# Altium project Kar_PCB.PrjPcb
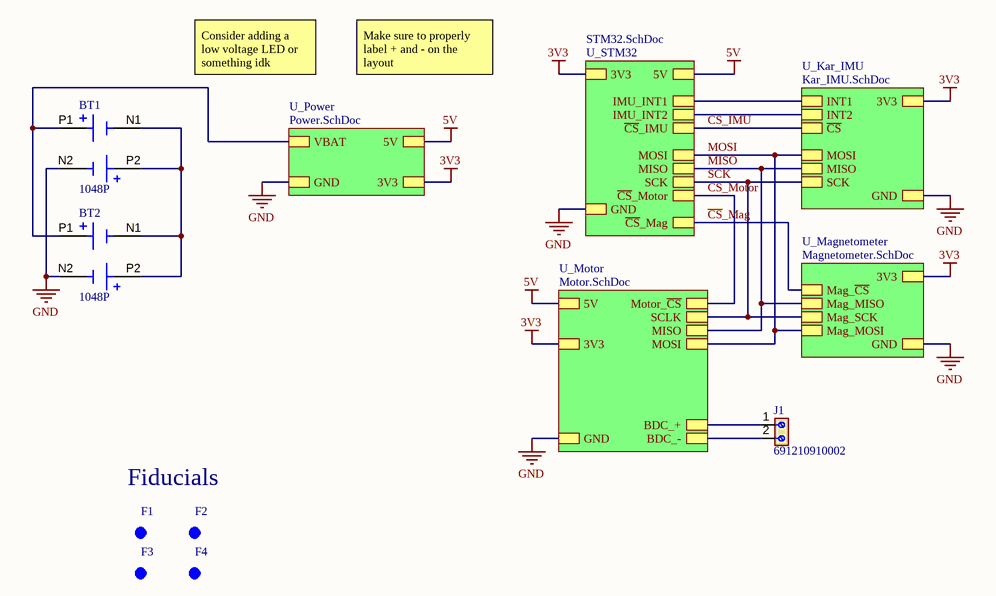
[diagram p0: Kar_PCB.SchDoc]
CAGE_CODE: ?????; CONTRACT_NUMBER: <CONTRACT NO>; DOC_NO_ASSY_DWG: <ASSY DWG NO>; DOC_NO_BOM: <BOM DOC NO>; DOC_NO_FAB_DWG: <FAB DWG NO>; DOC_NO_SCH_DWG: <SCH DWG NO>; PCB_2_DEC_TOL: +/-.01; PCB_3_DEC_TOL: +/-.010; PCB_ANG_TOL: +/-1/2; PCB_ASSEMBLY_NO: <PCB ASSY NO>; PCB_CHECKER: - -----; PCB_CHECKER_APP_DATE: --/--/----; PCB_DESIGNER: - -----; PCB_DESIGNER_APP_DATE: --/--/----; PCB_DWG_NO: <PCB DWG NO>; PCB_ENGINEER: - -----; PCB_ENGINEER_APP_DATE: --/--/----; PCB_PART_NUMBER: <PCB PN>; PCB_REV: A; SCH_REV: A
6 sheets, 55 parts. Net scope: strictly hierarchical (ports join the sheet entries above them; power ports are local).
Board file: Kar_PCB.PcbDoc
Sheets:
  Kar_PCB.SchDoc
    U_Motor = Motor.SchDoc
    U_Power = Power.SchDoc
    U_STM32 = STM32.SchDoc
    U_Kar_IMU = Kar_IMU.SchDoc
    U_Magnetometer = Magnetometer.SchDoc

## Sheet Kar_PCB.SchDoc
size 241 x 190 mm; SheetNumber: 1; SheetTotal: 6; ENG_APP_DATE: --/--/--; DSN_APP_DATE: --/--/--; CHK_APP_DATE: --/--/--

### Parts
BT1  1048P  [BAT_1048P]
BT2  1048P  [BAT_1048P]
F1  Fiducial  [Fiducial_Footprint]  (value not drawn)
F2  Fiducial  [Fiducial_Footprint]  (value not drawn)
F3  Fiducial  [Fiducial_Footprint]  (value not drawn)
F4  Fiducial  [Fiducial_Footprint]  (value not drawn)
J1  691210910002  [691210910002]

### Sub-sheets
U_Kar_IMU = Kar_IMU.SchDoc: 3V3, GND, ~{CS}, SCK, MISO, MOSI, INT1, INT2
U_Magnetometer = Magnetometer.SchDoc: 3V3, GND, Mag_~{CS}, Mag_MISO, Mag_SCK, Mag_MOSI
U_Motor = Motor.SchDoc: 5V, GND, BDC_+, BDC_-, MOSI, Motor_~{CS}, SCLK, 3V3, MISO
U_Power = Power.SchDoc: VBAT, GND, 5V, 3V3
U_STM32 = STM32.SchDoc: MOSI, MISO, SCK, 3V3, GND, ~{CS}_Motor, ~{CS}_IMU, IMU_INT2, IMU_INT1, 5V, ~{CS}_Mag

### Nets
3V3: sheet U_Motor/3V3, sheet U_Power/3V3, sheet U_STM32/3V3, sheet U_Kar_IMU/3V3, sheet U_Magnetometer/3V3
5V: sheet U_Motor/5V, sheet U_Power/5V, sheet U_STM32/5V
GND: BT1.N2 BT2.N2 ; sheet U_Motor/GND, sheet U_Power/GND, sheet U_STM32/GND, sheet U_Kar_IMU/GND, sheet U_Magnetometer/GND
VBAT: BT1.P1 BT2.P1 ; sheet U_Power/VBAT
~{CS}_IMU: sheet U_STM32/~{CS}_IMU, sheet U_Kar_IMU/~{CS}
~{CS}_Mag: sheet U_STM32/~{CS}_Mag, sheet U_Magnetometer/Mag_~{CS}
~{CS}_Motor: sheet U_Motor/Motor_~{CS}, sheet U_STM32/~{CS}_Motor
MISO: sheet U_Motor/MISO, sheet U_STM32/MISO, sheet U_Kar_IMU/MISO, sheet U_Magnetometer/Mag_MISO
MOSI: sheet U_Motor/MOSI, sheet U_STM32/MOSI, sheet U_Kar_IMU/MOSI, sheet U_Magnetometer/Mag_MOSI
SCK: sheet U_Motor/SCLK, sheet U_STM32/SCK, sheet U_Kar_IMU/SCK, sheet U_Magnetometer/Mag_SCK
NetBT1_N1: BT1.N1 BT1.P2 BT2.N1 BT2.P2
NetJ1_1: J1.1 ; sheet U_Motor/BDC_+
NetJ1_2: J1.2 ; sheet U_Motor/BDC_-
NetMT1_4: sheet U_STM32/IMU_INT1, sheet U_Kar_IMU/INT1
NetMT1_9: sheet U_STM32/IMU_INT2, sheet U_Kar_IMU/INT2

### Notes on the sheet
- Consider adding a low voltage LED or something idk
- Make sure to properly label + and - on the layout
- Fiducials
- DWG. NO.
- REV.
- SHT.
- THIS DOCUMENT AND THE DATA DISCLOSED HEREIN OR HEREWITH IS THE PROPERTY OF ALTIUM LIMITED AND MAY BE FREELY DISTRIBUTED IN WHOLE. NO RIGHTS ARE RESERVED OR EXPRESS OR IMPLIED WARANTEE GIVEN.
- REVISION
- DESCRIPTION
- DATE
- APPROVED
- ENG:
- APPROVALS
- PROJECT
- DSN:
- CHK:
- REFERENCE DOCUMENTS
- PROJECT REVISION:
- TITLE
- DOCUMENT REVISION:
- DESIGN ITEM:
- BOM:
- FAB DWG:
- PCB DWG:
- ASSY DWG:
- SCALE:
- SIZE
- B
- CAGE CODE
- FILE NAME
- DWG NO.
- SHEET
- OF
- REV

### Library data of the parts
BT1 BT2 = 1048P: SMT Polarized Holder for Dual 18650 Batteries; MF: Keystone Electronics; Value: *; MP: 1048P; Price: None; Package: None; Availability: In Stock; SnapEDA_Link: https://www.snapeda.com/parts/1048P/Keystone+Electronics/view-part/?ref=snap; Purchase-URL: https://pricing.snapeda.com/search/part/1048P/?ref=eda; Check_prices: https://www.snapeda.com/parts/1048P/Keystone+Electronics/view-part/?ref=eda
J1 = 691210910002: MF: {'manufacturer': u'W\xfcrth Elektronik'}; Package: None; Price: None; Value: *; MP: 691210910002; Availability: Unavailable

## Sheet Motor.SchDoc
size A; SheetNumber: 3; SheetTotal: 6
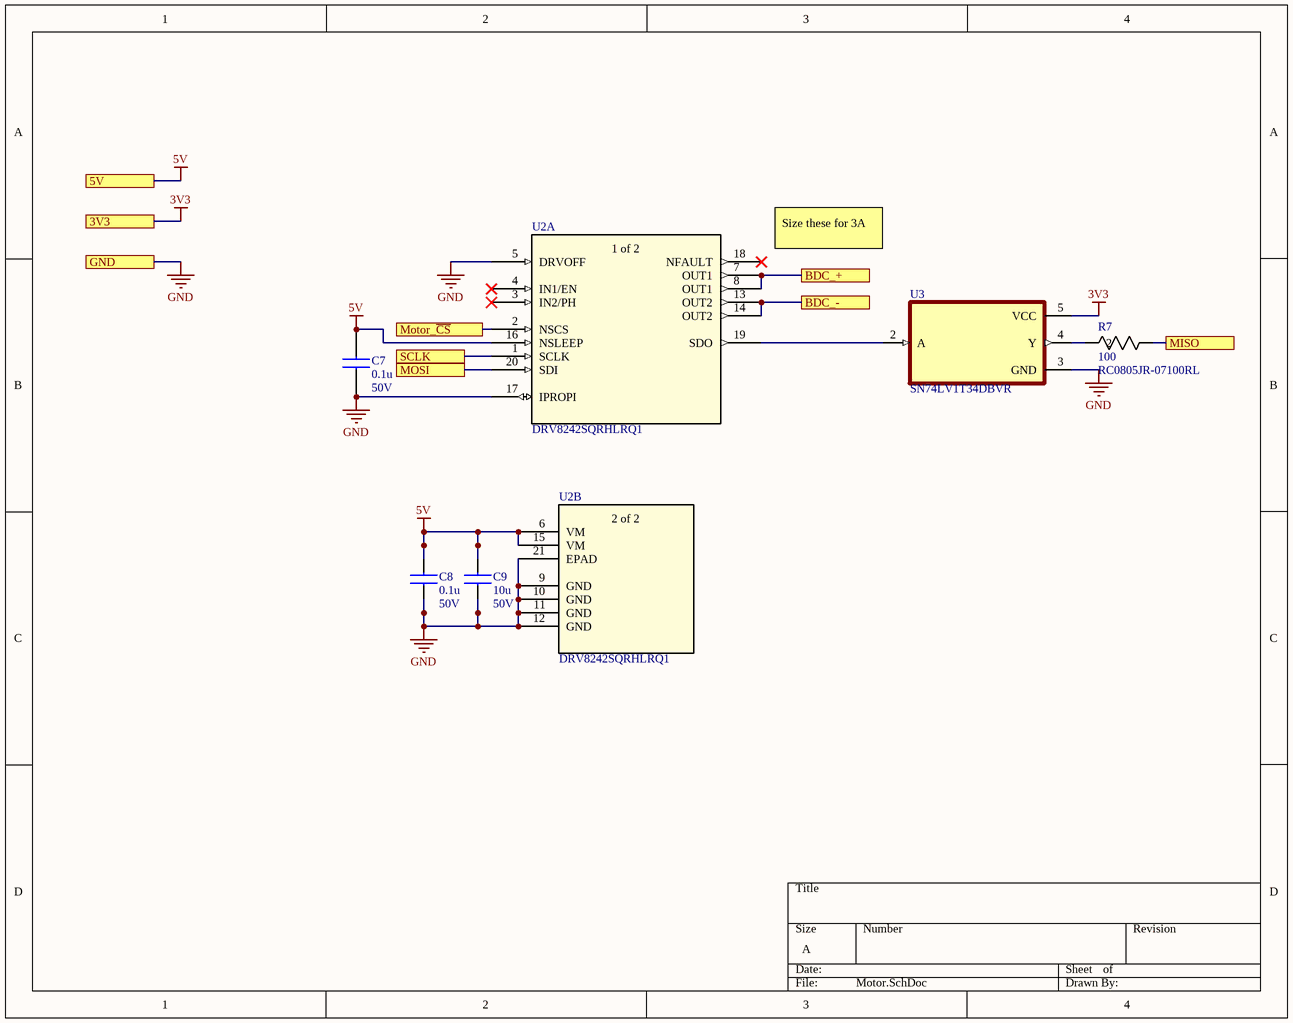
[diagram p1: Motor.SchDoc]

### Parts
C7  value 0.1u  Rated Voltage: 50V  [CAPC2012X145N]  (hidden comment: KAM21BR71H104JM)
C8  value 0.1u  Rated Voltage: 50V  [CAPC2012X145N]  (hidden comment: KAM21BR71H104JM)
C9  value 10u  Rated Voltage: 50V  [CAPC2012X145N]  (hidden comment: C2012X5R1H106K125AC)
R7  RC0805JR-07100RL  value 100  [RC0805N_YAG]
U2  DRV8242SQRHLRQ1  [VQFN20_RHL_TEX]  (parts A,B of 2)
U3  SN74LV1T34DBVR  [SOT95P280X145-5N]

### Ports
3V3, 5V, BDC_+, BDC_-, GND, MISO, MOSI, Motor_~{CS}, SCLK

### Nets
3V3: U3.5(VCC) ; port 3V3
5V: C7.2 C8.2 C9.2 U2.6(VM) U2.15(VM) U2.16(NSLEEP) ; port 5V
GND: C7.1 C8.1 C9.1 U2.5(DRVOFF) U2.9(GND) U2.10(GND) U2.11(GND) U2.12(GND) U2.17(IPROPI) U2.21(EPAD) U3.3(GND) ; port GND
~{CS}_Motor: U2.2(NSCS) ; port Motor_~{CS}
MISO: R7.1 ; port MISO
MOSI: U2.20(SDI) ; port MOSI
SCK: U2.1(SCLK) ; port SCLK
NetJ1_1: U2.7(OUT1) U2.8(OUT1) ; port BDC_+
NetJ1_2: U2.13(OUT2) U2.14(OUT2) ; port BDC_-
NetR7_2: R7.2 U3.4(Y)
NetU2_19: U2.19(SDO) U3.2(A)

Not connected (* = marked no-connect by the designer): U2 3(IN2/PH)* 4(IN1/EN)* 18(NFAULT)*

### Notes on the sheet
- Size these for 3A
- (in symbol DRV8242SQRHLRQ1, part A) 1 of 2
- (in symbol DRV8242SQRHLRQ1, part B) 2 of 2

### Library data of the parts
C7 C8 = KAM21BR71H104JM: Multilayer Ceramic Chip Capacitors, Capacitance=0.1u; Manufacturer_Part_Number: KAM21BR71H104JM
C9 = C2012X5R1H106K125AC: Multilayer Ceramic Chip Capacitors, Capacitance=10?F, LxWxT:2x1.25x1.25mm; Manufacturer_Name: TDK; Geometry.Height: 1.45mm; Mouser Part Number: 810-C2012X5R1H106K12; Mouser Price/Stock: https://www.mouser.co.uk/ProductDetail/TDK/C2012X5R1H106K125AC?qs=rSMjJ%252B1ewcQGpfDVduhUmg%3D%3D; Manufacturer_Part_Number: C2012X5R1H106K125AC; Datasheet Link: https://product.tdk.com/info/en/catalog/datasheets/mlcc_commercial_midvoltage_en.pdf
R7 = RC0805JR-07100RL: RES 0805 100 5% 1/8W; Manufacturer_Name: Yageo; Manufacturer_Part_Number: RC0805JR-07100RL; Tolerance: 5%
U2 = DRV8242SQRHLRQ1: Automotive, 40-V 6-A H-bridge driver with integrated current sensing and feedback 20-VQFN -40 to 125; Manufacturer_Name: Texas Instruments; Type: Power Management; Copyright: Copyright (C) 2025 Ultra Librarian. All rights reserved.; Manufacturer_Part_Number: DRV8242SQRHLRQ1; Datasheet: https://www.ti.com/lit/gpn/drv8242-q1; RefDes: RefDes
U3 = SN74LV1T34DBVR: Single Power Supply BUFFER Logic Level Shifter (no enable); MF: Texas Instruments; SnapEDA_Link: https://www.snapeda.com/parts/SN74LV1T34DBVR/Texas+Instruments/view-part/?ref=snap; Package: SOT-23-5 Texas Instruments; Value: *; MP: SN74LV1T34DBVR; Check_prices: https://www.snapeda.com/parts/SN74LV1T34DBVR/Texas+Instruments/view-part/?ref=eda

## Sheet Power.SchDoc
size A; SheetNumber: 2; SheetTotal: 6
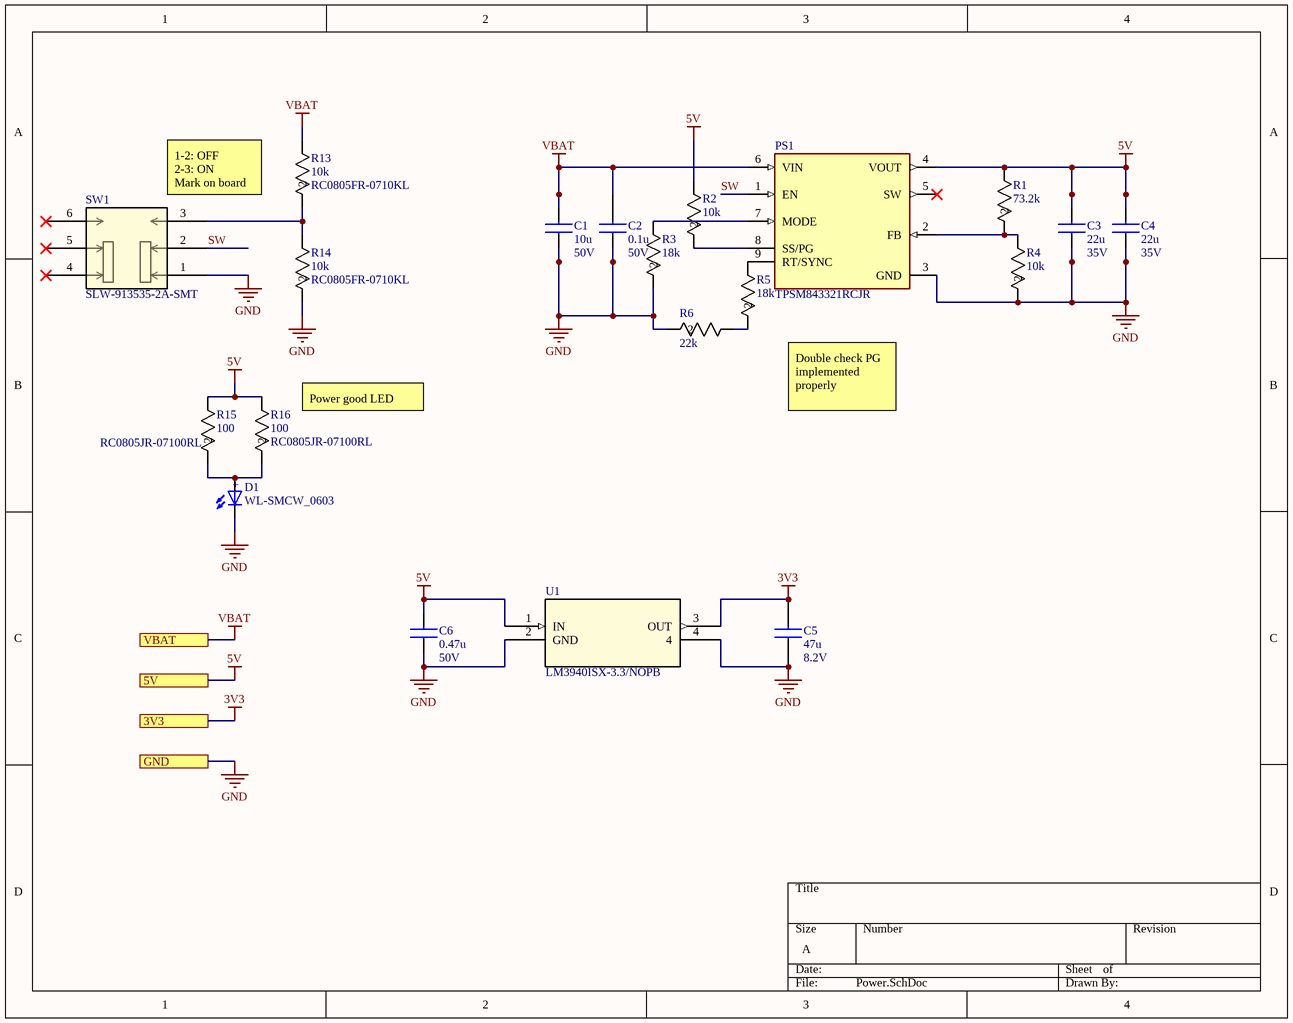
[diagram p2: Power.SchDoc]

### Parts
C1  value 10u  Rated Voltage: 50V  [CAPC2012X145N]  (hidden comment: C2012X5R1H106K125AC)
C2  value 0.1u  Rated Voltage: 50V  [CAPC2012X145N]  (hidden comment: KAM21BR71H104JM)
C3  value 22u  Rated Voltage: 35V  [CAPC2012X145N]  (hidden comment: C2012X5R1V226M125AC)
C4  value 22u  Rated Voltage: 35V  [CAPC2012X145N]  (hidden comment: C2012X5R1V226M125AC)
C5  value 47u  Rated Voltage: 8.2V  [CAPC2012X145N]  (hidden comment: T58W0476M8R2C0500)
C6  value 0.47u  Rated Voltage: 50V  [CAPC2012X145N]  (hidden comment: GCM21BR71H474KA55K)
D1  WL-SMCW_0603  [WL-SMCW_0603]
PS1  TPSM843321RCJR  [MODULE_TPSM843321RCJR]
R1  value 73.2k  [RC0805N_YAG]  (hidden comment: RC0805FR-0773K2L)
R2  value 10k  [RC0805N_YAG]  (hidden comment: RC0805FR-0710KL)
R3  value 18k  [RC0805N_YAG]  (hidden comment: RC0805FR-0718KL)
R4  value 10k  [RC0805N_YAG]  (hidden comment: RC0805FR-0710KL)
R5  value 18k  [RC0805N_YAG]  (hidden comment: RC0805FR-0718KL)
R6  value 22k  [RC0805N_YAG]  (hidden comment: RC0805FR-0722KL)
R13  RC0805FR-0710KL  value 10k  [RC0805N_YAG]
R14  RC0805FR-0710KL  value 10k  [RC0805N_YAG]
R15  RC0805JR-07100RL  value 100  [RC0805N_YAG]
R16  RC0805JR-07100RL  value 100  [RC0805N_YAG]
SW1  SLW-913535-2A-SMT  [SLW-913535_CUD]
U1  LM3940ISX-3.3/NOPB  [TS3B]

### Ports
3V3, 5V, GND, VBAT

### Nets
3V3: C5.2 U1.3(OUT) ; port 3V3
5V: C3.2 C4.2 C6.2 PS1.4(VOUT) R1.1 R2.1 R15.1 R16.1 U1.1(IN) ; port 5V
GND: C1.1 C2.1 C3.1 C4.1 C5.1 C6.1 D1.1(NEG) PS1.3(GND) R3.2 R4.2 R6.2 R14.2 SW1.1 U1.2(GND) U1.4 ; port GND
VBAT: C1.2 C2.2 PS1.6(VIN) R13.1 ; port VBAT
SW: PS1.1(EN) SW1.2
NetD1_2: D1.2(POS) R15.2 R16.2
NetPS1_2: PS1.2(FB) R1.2 R4.1
NetPS1_7: PS1.7(MODE) R3.1
NetPS1_8: PS1.8(SS/PG) R2.2
NetPS1_9: PS1.9(RT/SYNC) R5.1
NetR5_2: R5.2 R6.1
NetR13_2: R13.2 R14.1 SW1.3

Not connected (* = marked no-connect by the designer): PS1 5(SW)*; SW1 4* 5* 6*

### Notes on the sheet
- 1-2: OFF
  2-3: ON
  Mark on board
- (near R16) Power good LED
- Double check PG implemented properly
- (in symbol WL-SMCW_0603) +

### Library data of the parts
C1 = C2012X5R1H106K125AC: as C9 on sheet Motor; Mouser Part Number: 810-C2012X5R1H106K12; Mouser Price/Stock: https://www.mouser.co.uk/ProductDetail/TDK/C2012X5R1H106K125AC?qs=rSMjJ%252B1ewcQGpfDVduhUmg%3D%3D; Manufacturer_Part_Number: C2012X5R1H106K125AC; Datasheet Link: https://product.tdk.com/info/en/catalog/datasheets/mlcc_commercial_midvoltage_en.pdf
C2 = KAM21BR71H104JM: as C7 on sheet Motor; Manufacturer_Part_Number: KAM21BR71H104JM
C3 C4 = C2012X5R1V226M125AC: Multilayer Ceramic Chip Capacitors, Capacitance=22u; Manufacturer_Part_Number: C2012X5R1V226M125AC
C5 = T58W0476M8R2C0500: 47 µF Molded Tantalum Polymer Capacitor 8.2 V 0805 (2012 Metric) 500mOhm @ 100kHz; Manufacturer_Part_Number: T58W0476M8R2C0500
C6 = GCM21BR71H474KA55K: Multilayer Ceramic Chip Capacitors, Capacitance=0.47u; Manufacturer_Part_Number: GCM21BR71H474KA55K
D1 = WL-SMCW_0603: 0603, Green Typ.(@20mA): 520nm, 430mcd, 3.2V, 140Â° InGaN; MF: Wurth Electronics; MP: 150060GS75000; SnapEDA_Link: https://www.snapeda.com/parts/150060GS75000/Wurth+Electronics/view-part/?ref=snap; Package: 0603 WÃ¼rth Elektronik; Value: *; Check_prices: https://www.snapeda.com/parts/150060GS75000/Wurth+Electronics/view-part/?ref=eda
PS1 = TPSM843321RCJR: Non-Isolated PoL Module DC DC Converter 1 Output 5V 3A 3.8V - 18V Input; MF: Texas Instruments; SnapEDA_Link: https://www.snapeda.com/parts/TPSM843321RCJR/Texas+Instruments/view-part/?ref=snap; Package: None; Value: *; MP: TPSM843321RCJR; Check_prices: https://www.snapeda.com/parts/TPSM843321RCJR/Texas+Instruments/view-part/?ref=eda
R1 = RC0805FR-0773K2L: RES 0805 73.2k 1% 1/8W; Manufacturer_Name: Yageo; Manufacturer_Part_Number: RC0805FR-0773K2L; Tolerance: 1%
R2 R4 R13 R14 = RC0805FR-0710KL: RES 0805 10k 1% 1/8W; Manufacturer_Name: Yageo; Manufacturer_Part_Number: RC0805FR-0710KL; Tolerance: 1%
R3 R5 = RC0805FR-0718KL: RES 0805 18k 1% 1/8W; Manufacturer_Name: Yageo; Manufacturer_Part_Number: RC0805FR-0718KL; Tolerance: 1%
R6 = RC0805FR-0722KL: RES 0805 22k 1% 1/8W; Manufacturer_Name: Yageo; Manufacturer_Part_Number: RC0805FR-0722KL; Tolerance: 1%
R15 R16 = RC0805JR-07100RL: as R7 on sheet Motor; Manufacturer_Part_Number: RC0805JR-07100RL; Tolerance: 5%
SW1 = SLW-913535-2A-SMT: No Description Available; Manufacturer_Name: Same Sky; Type: Slide Switches; Copyright: Copyright (C) 2025 Ultra Librarian. All rights reserved.; Manufacturer_Part_Number: SLW-913535-2A-SMT; RefDes: RefDes
U1 = LM3940ISX-3.3NOPB: 1-A, low-dropout voltage regulator for 5-V to 3.3-V conversion 3-DDPAK/TO-263 -40 to 125; Manufacturer_Name: Texas Instruments; Type: LM3940IS-3.3; Copyright: Copyright (C) 2025 Ultra Librarian. All rights reserved.; Manufacturer_Part_Number: LM3940ISX-3.3/NOPB; Datasheet: https://www.ti.com/lit/gpn/lm3940; RefDes: RefDes

## Sheet STM32.SchDoc
size A; SheetNumber: 4; SheetTotal: 6
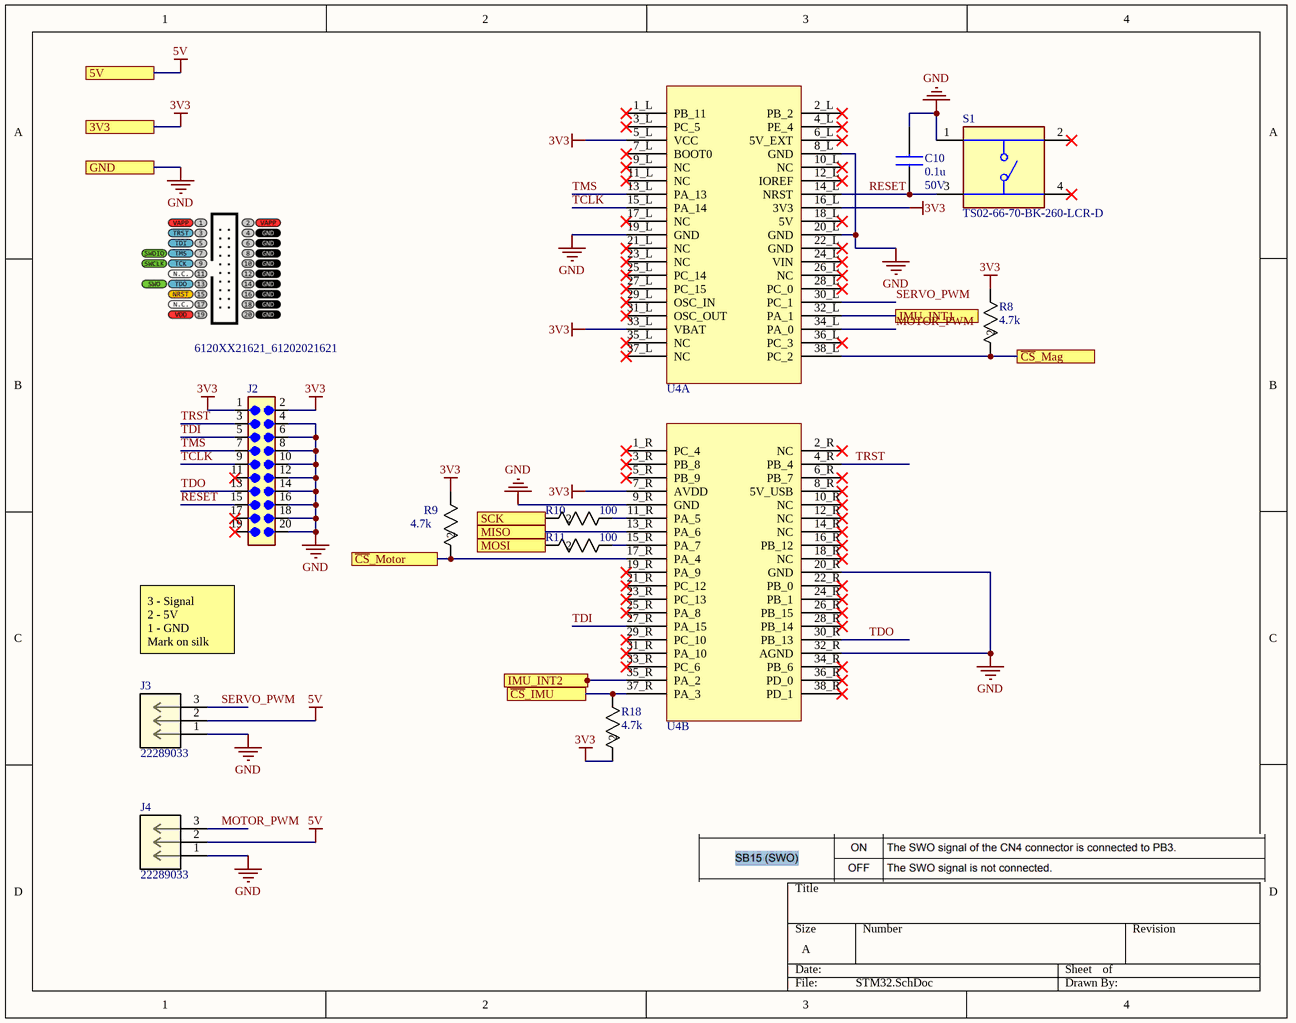
[diagram p3: STM32.SchDoc]

### Parts
C10  value 0.1u  Rated Voltage: 50V  [CAPC2012X145N]  (hidden comment: KAM21BR71H104JM)
J2  6120XX21621_61202021621  [61202021621]
J3  22289033  [CONN03_22289033_MOL]
J4  22289033  [CONN03_22289033_MOL]
R8  value 4.7k  [RC0805N_YAG]  (hidden comment: RC0805JR-074K7L)
R9  value 4.7k  [RC0805N_YAG]  (hidden comment: RC0805JR-074K7L)
R10  value 100  [RC0805N_YAG]  (hidden comment: RC0805JR-07100RL)
R11  value 100  [RC0805N_YAG]  (hidden comment: RC0805JR-07100RL)
R18  value 4.7k  [RC0805N_YAG]  (hidden comment: RC0805JR-074K7L)
S1  TS02-66-70-BK-260-LCR-D  [SW_TS02-66-70-BK-260-LCR-D]
U4  STM32_WB55  [PCBComponent_1]  (value not drawn)  (parts A,B of 2)

### Ports
3V3, 5V, GND, IMU_INT1, IMU_INT2, MISO, MOSI, SCK, ~{CS}_IMU, ~{CS}_Mag, ~{CS}_Motor

### Nets
3V3: J2.1 J2.2 R8.1 R9.1 R18.2 U4.5_L(VCC) U4.7_R(AVDD) U4.16_L(3V3) U4.33_L(VBAT) ; port 3V3
5V: J3.2 J4.2 ; port 5V
GND: C10.2 J2.4 J2.6 J2.8 J2.10 J2.12 J2.14 J2.16 J2.18 J2.20 J3.1 J4.1 S1.1 U4.8_L(GND) U4.9_R(GND) U4.19_L(GND) U4.20_L(GND) U4.20_R(GND) U4.32_R(AGND) ; port GND
~{CS}_IMU: R18.1 U4.37_R(PA_3) ; port ~{CS}_IMU
~{CS}_Mag: R8.2 U4.38_L(PC_2) ; port ~{CS}_Mag
~{CS}_Motor: R9.2 U4.17_R(PA_4) ; port ~{CS}_Motor
MISO: U4.13_R(PA_6) ; port MISO
MOSI: R11.2 ; port MOSI
MOTOR_PWM: J4.3 U4.34_L(PA_0)
RESET: C10.1 J2.15 S1.3 U4.14_L(NRST)
SCK: R10.2 ; port SCK
SERVO_PWM: J3.3 U4.30_L(PC_1)
TCLK: J2.9 U4.15_L(PA_14)
TDI: J2.5 U4.27_R(PA_15)
TDO: J2.13 U4.30_R(PB_13)
TMS: J2.7 U4.13_L(PA_13)
TRST: J2.3 U4.4_R(PB_4)
NetMT1_4: U4.32_L(PA_1) ; port IMU_INT1
NetMT1_9: U4.35_R(PA_2) ; port IMU_INT2
NetR10_1: R10.1 U4.11_R(PA_5)
NetR11_1: R11.1 U4.15_R(PA_7)

Not connected (* = marked no-connect by the designer): J2 11* 17* 19*; S1 2* 4*; U4 1_L(PB_11)* 1_R(PC_4)* 2_L(PB_2)* 2_R(NC)* 3_L(PC_5)* 3_R(PB_8)* 4_L(PE_4)* 5_R(PB_9)* 6_L(5V_EXT)* 6_R(PB_7)* 7_L(BOOT0)* 8_R(5V_USB)* 9_L(NC)* 10_L(NC)* 10_R(NC)* 11_L(NC)* 12_L(IOREF)* 12_R(NC)* 14_R(NC)* 16_R(PB_12)* 17_L(NC)* 18_L(5V)* 18_R(NC)* 19_R(PA_9)* 21_L(NC)* 21_R(PC_12)* 22_L(GND)* 22_R(PB_0)* 23_L(NC)* 23_R(PC_13)* 24_L(VIN)* 24_R(PB_1)* 25_L(PC_14)* 25_R(PA_8)* 26_L(NC)* 26_R(PB_15)* 27_L(PC_15)* 28_L(PC_0)* 28_R(PB_14)* 29_L(OSC_IN)* 29_R(PC_10)* 31_L(OSC_OUT)* 31_R(PA_10)* 33_R(PC_6)* 34_R(PB_6)* 35_L(NC)* 36_L(PC_3)* 36_R(PD_0)* 37_L(NC)* 38_R(PD_1)*

### Notes on the sheet
- 3 - Signal
  2 - 5V
  1 - GND
  Mark on silk

### Library data of the parts
C10 = KAM21BR71H104JM: as C7 on sheet Motor; Manufacturer_Part_Number: KAM21BR71H104JM
J2 = 6120XX21621_61202021621: MF: {'manufacturer': u'W\xfcrth Elektronik'}; Package: None; Price: None; Value: *; MP: 61202021621; Availability: Unavailable
J3 J4 = 22289033: KK 254 Breakaway Header, Right-Angle Surface Mount Compatible, 3 Circuits, 0.38Âµm Gold (Au) Selective Plating, Mating Pin Length 8.23mm, with Kinked PC Tails; Manufacturer_Name: Molex Connector Corporation; Copyright: Copyright (C) 2025 Ultra Librarian. All rights reserved.; Manufacturer_Part_Number: 22289033; Datasheet: https://www.molex.com/en-us/products/part-detail-pdf/22289033?display=pdf; RefDes: RefDes; Type: Type
R8 R9 R18 = RC0805JR-074K7L: RES 0805 4.7k 5% 1/8W; Manufacturer_Name: Yageo; Manufacturer_Part_Number: RC0805JR-074K7L; Tolerance: 5%
R10 R11 = RC0805JR-07100RL: as R7 on sheet Motor; Manufacturer_Part_Number: RC0805JR-07100RL; Tolerance: 5%
S1 = TS02-66-70-BK-260-LCR-D: 6 x 6 mm, 7 mm Actuator Height, 260 gf, Black, Long Crimped, Through Hole, SPST, Tactile Switch; MF: Same Sky; SnapEDA_Link: https://www.snapeda.com/parts/TS02-66-70-BK-260-LCR-D/Same+Sky/view-part/?ref=snap; Package: None; Value: *; MP: TS02-66-70-BK-260-LCR-D; Check_prices: https://www.snapeda.com/parts/TS02-66-70-BK-260-LCR-D/Same+Sky/view-part/?ref=eda

## Sheet Kar_IMU.SchDoc
size A; SheetNumber: 5; SheetTotal: 6
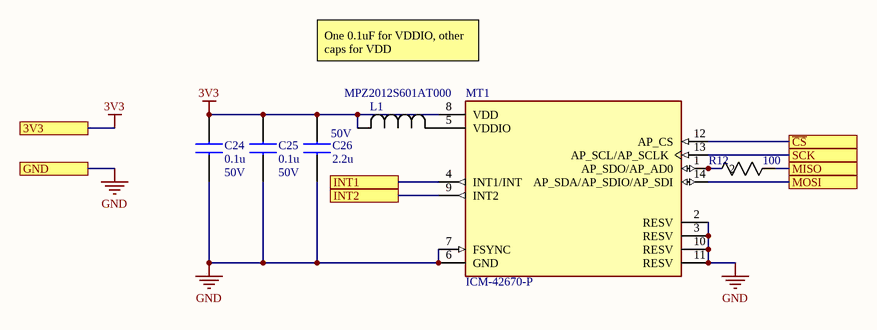
[diagram p4: Kar_IMU.SchDoc]

### Parts
C24  value 0.1u  Rated Voltage: 50V  [CAPC2012X145N]  (hidden comment: KAM21BR71H104JM)
C25  value 0.1u  Rated Voltage: 50V  [CAPC2012X145N]  (hidden comment: KAM21BR71H104JM)
C26  value 2.2u  Rated Voltage: 50V  [CAPC2012X145N]  (hidden comment: C2012X7R1H225K125AE)
L1  MPZ2012S601AT000  [IND_2012_TDK]
MT1  ICM-42670-P  [XDCR_ICM-42670-P]
R12  value 100  [RC0805N_YAG]  (hidden comment: RC0805JR-07100RL)

### Ports
3V3, GND, INT1, INT2, MISO, MOSI, SCK, ~{CS}

### Nets
3V3: C24.2 C25.2 C26.2 L1.2 MT1.8(VDD) ; port 3V3
GND: C24.1 C25.1 C26.1 MT1.2(RESV) MT1.3(RESV) MT1.6(GND) MT1.7(FSYNC) MT1.10(RESV) MT1.11(RESV) ; port GND
~{CS}_IMU: MT1.12(AP_CS) ; port ~{CS}
MISO: R12.1 ; port MISO
MOSI: MT1.14(AP_SDA/AP_SDIO/AP_SDI) ; port MOSI
SCK: MT1.13(AP_SCL/AP_SCLK) ; port SCK
NetL1_1: L1.1 MT1.5(VDDIO)
NetMT1_1: MT1.1(AP_SDO/AP_AD0) R12.2
NetMT1_4: MT1.4(INT1/INT) ; port INT1
NetMT1_9: MT1.9(INT2) ; port INT2

### Notes on the sheet
- One 0.1uF for VDDIO, other caps for VDD

### Library data of the parts
C24 C25 = KAM21BR71H104JM: as C7 on sheet Motor; Manufacturer_Part_Number: KAM21BR71H104JM
C26 = C2012X7R1H225K125AE: Multilayer Ceramic Chip Capacitors, Capacitance=2.2u; Manufacturer_Part_Number: C2012X7R1H225K125AE
L1 = MPZ2012S601AT000: No Description Available; Manufacturer_Name: TDK; Copyright: Copyright (C) 2025 Ultra Librarian. All rights reserved.; Manufacturer_Part_Number: MPZ2012S601AT000
R12 = RC0805JR-07100RL: as R7 on sheet Motor; Manufacturer_Part_Number: RC0805JR-07100RL; Tolerance: 5%
MT1 = ICM-42670-P: Package: None; Price: None; Value: *; MP: ICM-42670-P; Availability: Unavailable

## Sheet Magnetometer.SchDoc
size A; SheetNumber: 6; SheetTotal: 6
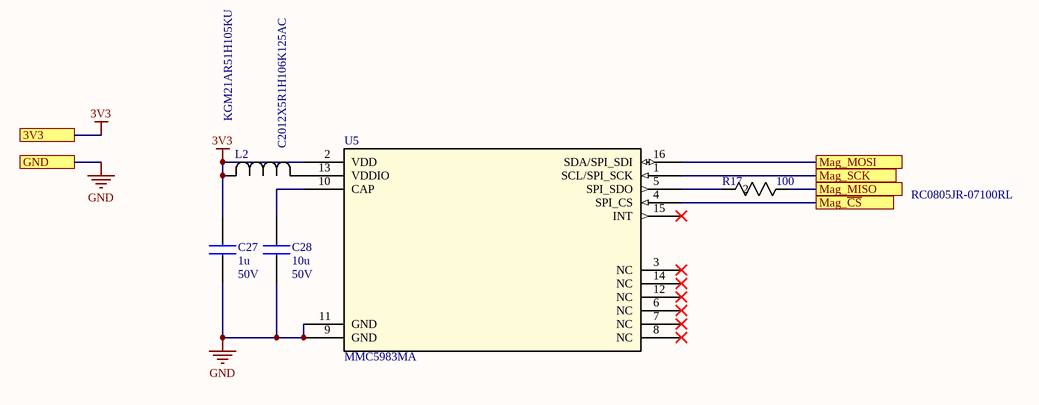
[diagram p5: Magnetometer.SchDoc]

### Parts
C27  KGM21AR51H105KU  value 1u  Rated Voltage: 50V  [CAPC2012X145N]
C28  C2012X5R1H106K125AC  value 10u  Rated Voltage: 50V  [CAPC2012X145N]
L2  MPZ2012S601AT000  [IND_2012_TDK]  (value not drawn)
R17  RC0805JR-07100RL  value 100  [RC0805N_YAG]
U5  MMC5983MA  [MMC5983MA_MEM]

### Ports
3V3, GND, Mag_MISO, Mag_MOSI, Mag_SCK, Mag_~{CS}

### Nets
3V3: C27.2 L2.2 U5.2(VDD) ; port 3V3
GND: C27.1 C28.1 U5.9(GND) U5.11(GND) ; port GND
~{CS}_Mag: U5.4(SPI_CS) ; port Mag_~{CS}
MISO: R17.1 ; port Mag_MISO
MOSI: U5.16(SDA/SPI_SDI) ; port Mag_MOSI
SCK: U5.1(SCL/SPI_SCK) ; port Mag_SCK
NetC28_2: C28.2 U5.10(CAP)
NetL2_1: L2.1 U5.13(VDDIO)
NetR17_2: R17.2 U5.5(SPI_SDO)

Not connected (* = marked no-connect by the designer): U5 3(NC)* 6(NC)* 7(NC)* 8(NC)* 12(NC)* 14(NC)* 15(INT)*

### Library data of the parts
C27 = KGM21AR51H105KU: Multilayer Ceramic Chip Capacitors, Capacitance=1u; Manufacturer_Part_Number: KGM21AR51H105KU
C28 = C2012X5R1H106K125AC: as C9 on sheet Motor; Mouser Part Number: 810-C2012X5R1H106K12; Mouser Price/Stock: https://www.mouser.co.uk/ProductDetail/TDK/C2012X5R1H106K125AC?qs=rSMjJ%252B1ewcQGpfDVduhUmg%3D%3D; Manufacturer_Part_Number: C2012X5R1H106K125AC; Datasheet Link: https://product.tdk.com/info/en/catalog/datasheets/mlcc_commercial_midvoltage_en.pdf
L2 = MPZ2012S601AT000: as L1 on sheet Kar_IMU; Copyright: Copyright (C) 2025 Ultra Librarian. All rights reserved.; Manufacturer_Part_Number: MPZ2012S601AT000
R17 = RC0805JR-07100RL: as R7 on sheet Motor; Manufacturer_Part_Number: RC0805JR-07100RL; Tolerance: 5%
U5 = MMC5983MA: No Description Available; Manufacturer_Name: Memsic; Copyright: Copyright (C) 2025 Ultra Librarian. All rights reserved.; Manufacturer_Part_Number: MMC5983MA; RefDes: RefDes; Type: Type

## Nets that join several sheets
3V3: Motor (U3.5), Power (C5.2 U1.3), STM32 (9 pins), Kar_IMU (5 pins), Magnetometer (C27.2 L2.2 U5.2)
5V: Motor (6 pins), Power (9 pins), STM32 (J3.2 J4.2)
GND: Kar_PCB (BT1.N2 BT2.N2), Motor (11 pins), Power (15 pins), STM32 (19 pins), Kar_IMU (9 pins), Magnetometer (C27.1 C28.1 U5.9 U5.11)
VBAT: Kar_PCB (BT1.P1 BT2.P1), Power (C1.2 C2.2 PS1.6 R13.1)
~{CS}_IMU: STM32 (R18.1 U4.37_R), Kar_IMU (MT1.12)
~{CS}_Mag: STM32 (R8.2 U4.38_L), Magnetometer (U5.4)
~{CS}_Motor: Motor (U2.2), STM32 (R9.2 U4.17_R)
MISO: Motor (R7.1), STM32 (U4.13_R), Kar_IMU (R12.1), Magnetometer (R17.1)
MOSI: Motor (U2.20), STM32 (R11.2), Kar_IMU (MT1.14), Magnetometer (U5.16)
NetJ1_1: Kar_PCB (J1.1), Motor (U2.7 U2.8)
NetJ1_2: Kar_PCB (J1.2), Motor (U2.13 U2.14)
NetMT1_4: STM32 (U4.32_L), Kar_IMU (MT1.4)
NetMT1_9: STM32 (U4.35_R), Kar_IMU (MT1.9)
SCK: Motor (U2.1), STM32 (R10.2), Kar_IMU (MT1.13), Magnetometer (U5.1)